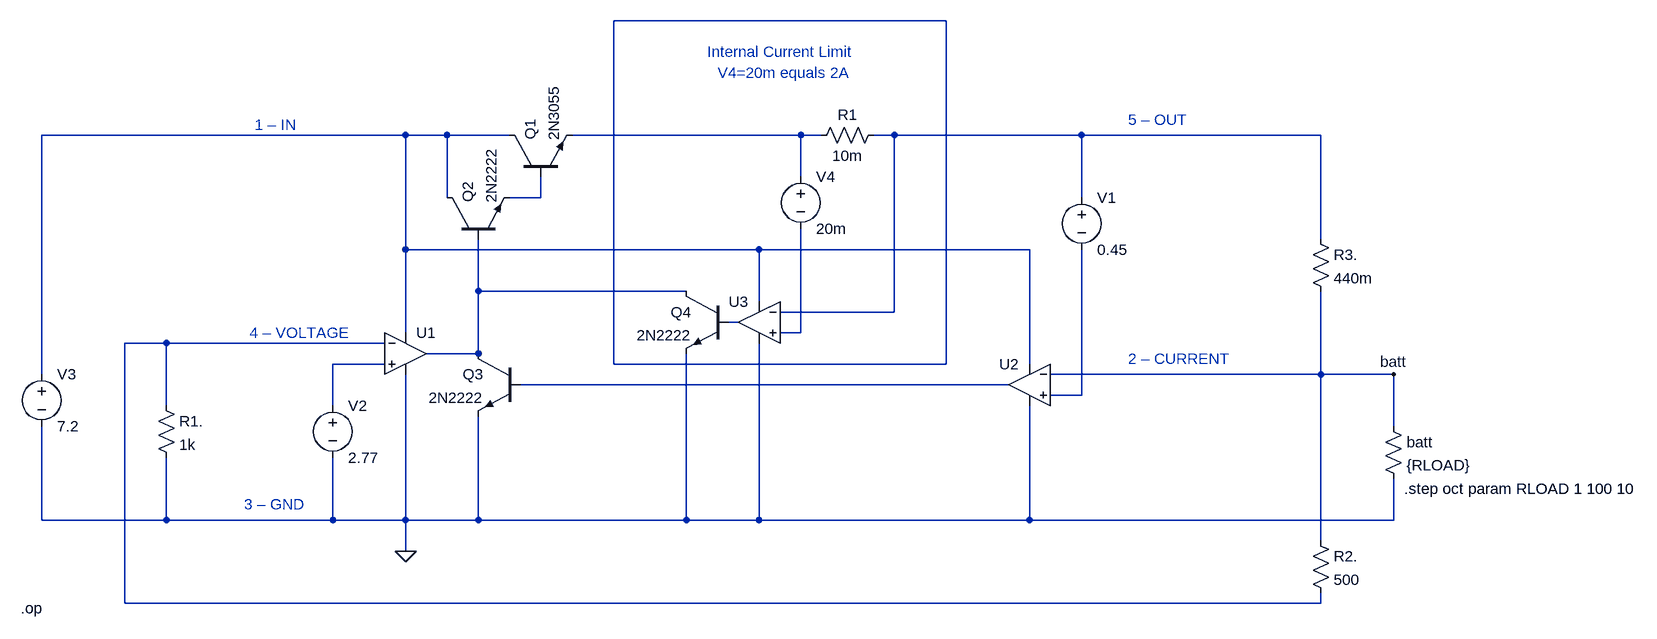
[diagram p0: schematic L200-0.asc]
L200-0.asc, the LTspice schematic file:
Version 4
SHEET 1 2244 680
WIRE 1024 -320 512 -320
WIRE 192 -144 -368 -144
WIRE 256 -144 192 -144
WIRE 352 -144 256 -144
WIRE 800 -144 448 -144
WIRE 832 -144 800 -144
WIRE 944 -144 912 -144
WIRE 1232 -144 944 -144
WIRE 1600 -144 1232 -144
WIRE 800 -80 800 -144
WIRE 256 -48 256 -144
WIRE 400 -48 400 -80
WIRE 400 -48 352 -48
WIRE 1232 -48 1232 -144
WIRE 1600 16 1600 -144
WIRE 192 32 192 -144
WIRE 736 32 192 32
WIRE 1152 32 736 32
WIRE 304 96 304 16
WIRE 624 96 304 96
WIRE 736 112 736 32
WIRE 944 128 944 -144
WIRE 944 128 768 128
WIRE 704 144 688 144
WIRE 192 160 192 32
WIRE 800 160 800 0
WIRE 800 160 768 160
WIRE -176 176 -240 176
WIRE 160 176 -176 176
WIRE 304 192 304 96
WIRE 304 192 224 192
WIRE 160 208 80 208
WIRE 512 208 512 -320
WIRE 1024 208 1024 -320
WIRE 1024 208 512 208
WIRE 1152 208 1152 32
WIRE -368 224 -368 -144
WIRE 1600 224 1600 96
WIRE 1600 224 1184 224
WIRE 1712 224 1600 224
WIRE 1120 240 368 240
WIRE 1232 256 1232 32
WIRE 1232 256 1184 256
WIRE -176 272 -176 176
WIRE 80 272 80 208
WIRE 1712 304 1712 224
WIRE -368 448 -368 304
WIRE -176 448 -176 352
WIRE -176 448 -368 448
WIRE 80 448 80 352
WIRE 80 448 -176 448
WIRE 192 448 192 224
WIRE 192 448 80 448
WIRE 304 448 304 288
WIRE 304 448 192 448
WIRE 624 448 624 192
WIRE 624 448 304 448
WIRE 736 448 736 176
WIRE 736 448 624 448
WIRE 1152 448 1152 272
WIRE 1152 448 736 448
WIRE 1712 448 1712 384
WIRE 1712 448 1152 448
WIRE 1600 480 1600 224
WIRE 192 496 192 448
WIRE -240 576 -240 176
WIRE 1600 576 1600 560
WIRE 1600 576 -240 576
FLAG 192 496 0
FLAG 1712 224 batt
SYMBOL npn 352 -80 R270
SYMATTR InstName Q1
SYMATTR Value 2N3055
SYMBOL Opamps\\UniversalOpamp2 192 192 R0
SYMATTR InstName U1
SYMBOL Opamps\\UniversalOpamp2 1152 240 M0
SYMATTR InstName U2
SYMBOL voltage 1232 -64 R0
WINDOW 123 0 0 Left 2
WINDOW 39 24 124 Left 2
SYMATTR InstName V1
SYMATTR Value 0.45
SYMBOL voltage 80 256 R0
WINDOW 123 0 0 Left 2
WINDOW 39 24 124 Left 2
SYMATTR InstName V2
SYMATTR Value 2.77
SYMBOL res -192 256 R0
SYMATTR InstName R1.
SYMATTR Value 1k
SYMBOL res 1584 464 R0
SYMATTR InstName R2.
SYMATTR Value 500
SYMBOL res 1584 0 R0
SYMATTR InstName R3.
SYMATTR Value 440m
SYMBOL voltage -368 208 R0
WINDOW 123 0 0 Left 2
WINDOW 39 24 124 Left 2
SYMATTR InstName V3
SYMATTR Value 7.2
SYMBOL res 1696 288 R0
SYMATTR InstName batt
SYMATTR Value {RLOAD}
SYMBOL npn 256 16 R270
SYMATTR InstName Q2
SYMATTR Value 2N2222
SYMBOL npn 368 192 M0
SYMATTR InstName Q3
SYMATTR Value 2N2222
SYMBOL res 928 -160 R90
WINDOW 0 0 56 VBottom 2
WINDOW 3 32 56 VTop 2
SYMATTR InstName R1
SYMATTR Value 10m
SYMBOL Opamps\\UniversalOpamp2 736 144 M0
SYMATTR InstName U3
SYMBOL voltage 800 -96 R0
WINDOW 123 0 0 Left 2
WINDOW 39 24 124 Left 2
SYMATTR InstName V4
SYMATTR Value 20m
SYMBOL npn 688 96 M0
SYMATTR InstName Q4
SYMATTR Value 2N2222
TEXT -400 584 Left 2 !.op
TEXT 1728 400 Left 2 !.step oct param RLOAD 1 100 10
TEXT -40 -160 Left 2 ;1 – IN
TEXT -56 424 Left 2 ;3 – GND
TEXT 1304 -168 Left 2 ;5 – OUT
TEXT 1304 200 Left 2 ;2 – CURRENT
TEXT -48 160 Left 2 ;4 – VOLTAGE
TEXT 656 -272 Left 2 ;Internal Current Limit
TEXT 672 -240 Left 2 ;V4=20m equals 2A

The netlist it stands for:
* L200-0.asc
Q1 N002 N005 N003 0 2N3055
XU1 N010 N009 N002 0 N006 level.2 Avol=1Meg GBW=10Meg Slew=10Meg ilimit=25m rail=0 Vos=0 phimargin=45 en=0 enk=0 in=0 ink=0 Rin=500Meg  ; pins IN+ IN- V+ V- OUT
XU2 N012 batt N002 0 N011 level.2 Avol=1Meg GBW=10Meg Slew=10Meg ilimit=25m rail=0 Vos=0 phimargin=45 en=0 enk=0 in=0 ink=0 Rin=500Meg  ; pins IN+ IN- V+ V- OUT
V1 N004 N012 0.45
V2 N010 0 2.77
R1. N009 0 1k
R2. batt N009 500
R3. N004 batt 440m
V3 N002 0 7.2
R§batt batt 0 {RLOAD}
Q2 N002 N006 N005 0 2N2222
Q3 N006 N011 0 0 2N2222
R1 N004 N003 10m
XU3 N008 N004 N002 0 N007 level.2 Avol=1Meg GBW=10Meg Slew=10Meg ilimit=25m rail=0 Vos=0 phimargin=45 en=0 enk=0 in=0 ink=0 Rin=500Meg  ; pins IN+ IN- V+ V- OUT
V4 N003 N008 20m
Q4 N006 N007 0 0 2N2222
.model NPN NPN
.model PNP PNP
.lib standard.bjt
.op
.step oct param RLOAD 1 100 10
* 1 – IN
* 3 – GND
* 5 – OUT
* 2 – CURRENT
* 4 – VOLTAGE
* Internal Current Limit
* V4=20m equals 2A
.lib UniversalOpamps2.sub
.backanno
.end